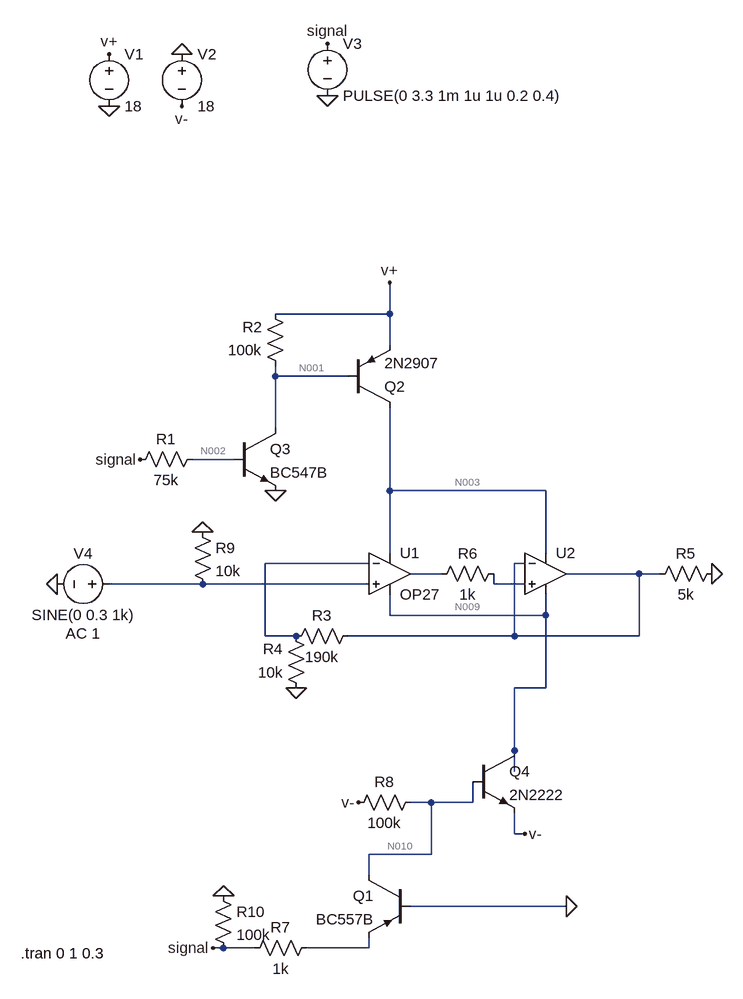
[diagram p0: schematic testAfAmpSwitch.asc]
testAfAmpSwitch.asc, the LTspice schematic file:
Version 4
SHEET 1 880 1260
WIRE 256 -128 256 -176
WIRE 256 -128 80 -128
WIRE 256 -80 256 -128
WIRE 80 -32 80 -48
WIRE 192 -32 80 -32
WIRE 80 48 80 -32
WIRE 16 96 -48 96
WIRE 256 144 256 16
WIRE 496 144 256 144
WIRE 256 240 256 144
WIRE 496 240 496 144
WIRE 224 256 64 256
WIRE 464 256 448 256
WIRE 336 272 288 272
WIRE 640 272 528 272
WIRE 672 272 640 272
WIRE -32 288 -176 288
WIRE 224 288 -32 288
WIRE 416 288 416 272
WIRE 464 288 416 288
WIRE 256 336 256 304
WIRE 496 336 496 304
WIRE 496 336 256 336
WIRE 64 368 64 256
WIRE 112 368 64 368
WIRE 448 368 448 256
WIRE 448 368 192 368
WIRE 640 368 640 272
WIRE 640 368 448 368
WIRE 496 448 496 336
WIRE 496 448 448 448
WIRE 448 544 448 448
WIRE 448 576 448 544
WIRE 320 624 288 624
WIRE 384 624 384 592
WIRE 384 624 320 624
WIRE 448 672 448 640
WIRE 464 672 448 672
WIRE 320 704 320 624
WIRE 320 704 224 704
WIRE 224 736 224 704
WIRE 528 784 288 784
WIRE 0 848 -16 848
WIRE 48 848 0 848
WIRE 224 848 224 832
WIRE 224 848 128 848
FLAG -64 -528 0
FLAG -176 -448 0
FLAG -176 -528 v+
FLAG 256 -176 v+
FLAG -64 -448 v-
FLAG 208 624 v-
FLAG 160 -464 0
FLAG 160 -544 signal
FLAG 80 144 0
FLAG 112 448 0
FLAG -256 288 0
FLAG 752 272 0
FLAG -128 96 signal
FLAG -16 848 signal
FLAG 528 784 0
FLAG 464 672 v-
FLAG -32 208 0
FLAG 0 768 0
SYMBOL OpAmps\\OP27 256 208 R0
SYMATTR InstName U1
SYMBOL pnp 288 736 M0
SYMATTR InstName Q1
SYMATTR Value BC557B
SYMBOL pnp 192 16 M180
SYMATTR InstName Q2
SYMATTR Value 2N2907
SYMBOL voltage -176 -544 R0
WINDOW 123 0 0 Left 0
WINDOW 39 0 0 Left 0
SYMATTR InstName V1
SYMATTR Value 18
SYMBOL voltage -64 -544 R0
WINDOW 123 0 0 Left 0
WINDOW 39 0 0 Left 0
SYMATTR InstName V2
SYMATTR Value 18
SYMBOL npn 16 48 R0
SYMATTR InstName Q3
SYMATTR Value BC547B
SYMBOL voltage 160 -560 R0
WINDOW 123 0 0 Left 0
WINDOW 39 0 0 Left 0
SYMATTR InstName V3
SYMATTR Value PULSE(0 3.3 1m 1u 1u 0.2 0.4)
SYMBOL res -32 80 R90
WINDOW 0 0 56 VBottom 2
WINDOW 3 32 56 VTop 2
SYMATTR InstName R1
SYMATTR Value 75k
SYMBOL res 96 -32 R180
WINDOW 0 36 76 Left 2
WINDOW 3 36 40 Left 2
SYMATTR InstName R2
SYMATTR Value 100k
SYMBOL res 208 352 R90
WINDOW 0 0 56 VBottom 2
WINDOW 3 32 56 VTop 2
SYMATTR InstName R3
SYMATTR Value 190k
SYMBOL res 128 464 R180
WINDOW 0 36 76 Left 2
WINDOW 3 36 40 Left 2
SYMATTR InstName R4
SYMATTR Value 10k
SYMBOL voltage -160 288 R90
WINDOW 0 -32 56 VBottom 2
WINDOW 3 32 56 VTop 2
WINDOW 123 60 56 VTop 2
WINDOW 39 0 0 Left 0
SYMATTR InstName V4
SYMATTR Value SINE(0 0.3 1k)
SYMATTR Value2 AC 1
SYMBOL res 768 256 R90
WINDOW 0 0 56 VBottom 2
WINDOW 3 32 56 VTop 2
SYMATTR InstName R5
SYMATTR Value 5k
SYMBOL res 432 256 R90
WINDOW 0 0 56 VBottom 2
WINDOW 3 32 56 VTop 2
SYMATTR InstName R6
SYMATTR Value 1k
SYMBOL OpAmps\\UniversalOpamp2 496 272 R0
SYMATTR InstName U2
SYMATTR SpiceLine ilimit=25 rail=0 Vos=0 phimargin=45
SYMBOL res 144 832 R90
WINDOW 0 0 56 VBottom 2
WINDOW 3 32 56 VTop 2
SYMATTR InstName R7
SYMATTR Value 1k
SYMBOL res 304 608 R90
WINDOW 0 0 56 VBottom 2
WINDOW 3 32 56 VTop 2
SYMATTR InstName R8
SYMATTR Value 100k
SYMBOL npn 384 544 R0
SYMATTR InstName Q4
SYMATTR Value 2N2222
SYMBOL res -48 192 R0
SYMATTR InstName R9
SYMATTR Value 10k
SYMBOL res -16 752 R0
SYMATTR InstName R10
SYMATTR Value 100k
TEXT -312 856 Left 2 !.tran 0 1 0.3

The netlist it stands for:
* testAfAmpSwitch.asc
XU1 N007 N004 N003 N009 N006 OP27  ; pins In+ In- V+ V- OUT
Q1 N010 0 N011 0 BC557B
Q2 N003 N001 v+ 0 2N2907
V1 v+ 0 18
V2 0 v- 18
Q3 N001 N002 0 0 BC547B
V3 signal 0 PULSE(0 3.3 1m 1u 1u 0.2 0.4)
R1 N002 signal 75k
R2 N001 v+ 100k
R3 N005 N004 190k
R4 0 N004 10k
V4 N007 0 SINE(0 0.3 1k) AC 1
R5 0 N005 5k
R6 N008 N006 1k
XU2 N008 N005 N003 N009 N005 level.2 Avol=1Meg GBW=10Meg Slew=10Meg ilimit=25 rail=0 Vos=0 phimargin=45 en=0 enk=0 in=0 ink=0 Rin=500Meg  ; pins IN+ IN- V+ V- OUT
R7 N011 signal 1k
R8 N010 v- 100k
Q4 N009 N010 v- 0 2N2222
R9 0 N007 10k
R10 0 signal 100k
.model NPN NPN
.model PNP PNP
.lib standard.bjt
.tran 0 1 0.3
.lib ADI.lib
.lib UniversalOpamps2.sub
.backanno
.end

* Results of the author's LTspice run, read from the files saved beside the schematic
* Operating Point, zero values left out:
*   V(n003) = 190.7 µV
*   V(n009) = -190.7 µV
*   V(n010) = -18 V
*   V(n001) = 18 V
*   V(v+) = 18 V
*   V(v-) = -18 V
*   V(n002) = 1.355 µV
*   Ic(Q4) = 18.01 pA
*   Ib(Q4) = -18 pA
*   Ic(Q3) = 18.09 pA
*   Ib(Q3) = -18.07 pA
*   Ic(Q2) = -18.01 pA
*   Ib(Q2) = 18 pA
*   Ic(Q1) = -18.36 pA
*   Ib(Q1) = 18.29 pA
*   I(R8) = 36.36 pA
*   I(R2) = -36.1 pA
*   I(R1) = 18.07 pA
*   I(V3) = 17.99 pA
*   I(V2) = -36.37 pA
*   I(V1) = -36.13 pA
*   Ix(u1:3) = -19.05 nA
*   Ix(u1:4) = 19.05 nA
*   Ix(u2:3) = 19.07 nA
*   Ix(u2:4) = -19.07 nA
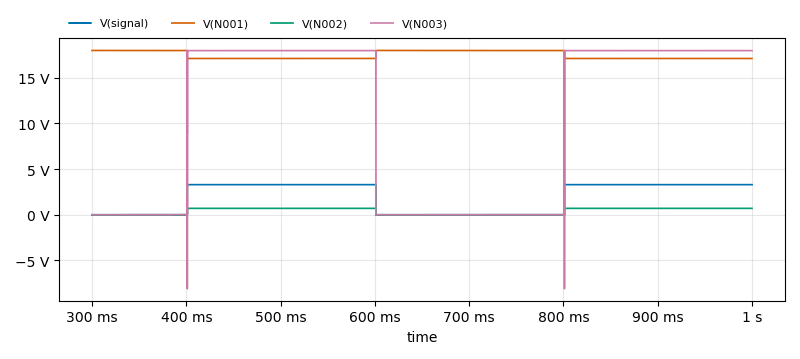
[diagram p1: Transient Analysis of testAfAmpSwitch.asc, plotted from the saved traces]
* Transient Analysis, 1 run:
*   V(signal): min 0 V, max 3.3 V, average 1.881 V, rms 2.491 V, last 3.3 V
*   V(N001): min 17.12 V, max 18.01 V, average 17.5 V, rms 17.5 V, last 17.12 V
*   V(N002): min -761.7 nV, max 703.6 mV, average 401 mV, rms 531.2 mV, last 703.6 mV
*   V(N003): min -8.111 V, max 17.99 V, average 10.25 V, rms 13.58 V, last 17.98 V